# Altium schematic sheet MCU.SchDoc
size A
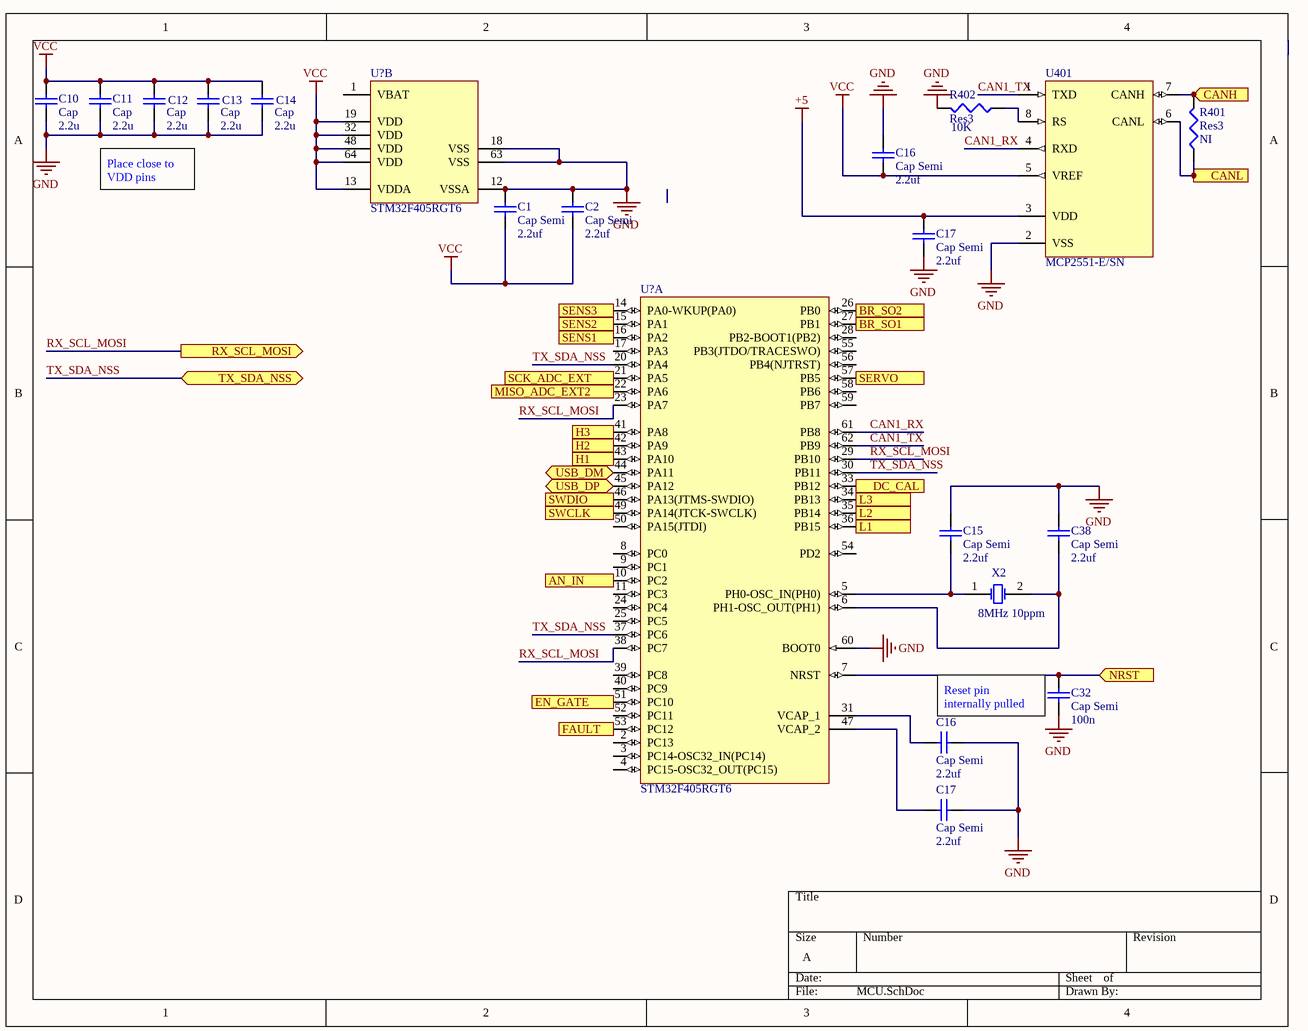
[diagram p0: MCU.SchDoc]

## Parts
(Parts that share a designator on the sheet are numbered #1, #2 ... from top to bottom, then left to right.)
C1  Cap Semi  value 2.2uf  [1608[0603]]
C2  Cap Semi  value 2.2uf  [1608[0603]]
C10  Cap  value 2.2u  [RAD-0.3]
C11  Cap  value 2.2u  [RAD-0.3]
C12  Cap  value 2.2u  [RAD-0.3]
C13  Cap  value 2.2u  [RAD-0.3]
C14  Cap  value 2.2u  [RAD-0.3]
C15  Cap Semi  value 2.2uf  [1608[0603]]
C16#1  Cap Semi  value 2.2uf  [1608[0603]]
C16#2  Cap Semi  value 2.2uf  [1608[0603]]
C17#1  Cap Semi  value 2.2uf  [1608[0603]]
C17#2  Cap Semi  value 2.2uf  [1608[0603]]
C32  Cap Semi  value 100n  [1608[0603]]
C38  Cap Semi  value 2.2uf  [1608[0603]]
R401  Res3  value NI  [J1-0603]
R402  Res3  value 10K  [J1-0603]
U401  MCP2551-E/SN  [SOIC-SN8_N]
U?#1  STM32F405RGT6  [STM-LQFP64_N]  (part B of 2)
U?#2  STM32F405RGT6  [STM-LQFP64_N]  (part A of 2)
X2  8MHz 10ppm  [R38]

## Ports
AN_IN (in), BR_SO1 (in), BR_SO2 (in), CANH (in), CANL (in), DC_CAL (out), EN_GATE (out), FAULT (in), H1 (out), H2 (out), H3 (out), L1 (out), L2 (out), L3 (out), MISO_ADC_EXT2 (in), NRST (in), RX_SCL_MOSI (out), SCK_ADC_EXT (in), SENS1 (in), SENS2 (in), SENS3 (in), SERVO (out), SWCLK (in), SWDIO (in), TX_SDA_NSS (bidir), USB_DM (bidir), USB_DP (bidir)

## Nets
+5: C17#1.2 U401.3(VDD)
GND: C1.2 C2.2 C10.1 C11.1 C12.1 C13.1 C14.1 C15.2 C16#1.2 C16#2.1 C17#1.1 C17#2.1 C32.1 C38.2 R402.2 U401.2(VSS) U?#1.12(VSSA) U?#1.18(VSS) U?#1.63(VSS) U?#2.60(BOOT0)
VCC: C1.1 C2.1 C10.2 C11.2 C12.2 C13.2 C14.2 C16#1.1 U401.5(VREF) U?#1.13(VDDA) U?#1.19(VDD) U?#1.32(VDD) U?#1.48(VDD) U?#1.64(VDD)
AN_IN: U?#2.10(PC2) ; port AN_IN
BR_SO1: U?#2.27(PB1) ; port BR_SO1
BR_SO2: U?#2.26(PB0) ; port BR_SO2
CAN1_RX: U401.4(RXD) U?#2.61(PB8)
CAN1_TX: U401.1(TXD) U?#2.62(PB9)
CANH: R401.2 U401.7(CANH) ; port CANH
CANL: R401.1 U401.6(CANL) ; port CANL
DC_CAL: U?#2.33(PB12) ; port DC_CAL
EN_GATE: U?#2.51(PC10) ; port EN_GATE
FAULT: U?#2.53(PC12) ; port FAULT
H1: U?#2.43(PA10) ; port H1
H2: U?#2.42(PA9) ; port H2
H3: U?#2.41(PA8) ; port H3
L1: U?#2.36(PB15) ; port L1
L2: U?#2.35(PB14) ; port L2
L3: U?#2.34(PB13) ; port L3
MISO_ADC_EXT2: U?#2.22(PA6) ; port MISO_ADC_EXT2
NRST: C32.2 U?#2.7(NRST) ; port NRST
RX_SCL_MOSI: U?#2.23(PA7) U?#2.29(PB10) U?#2.38(PC7) ; port RX_SCL_MOSI
SCK_ADC_EXT: U?#2.21(PA5) ; port SCK_ADC_EXT
SENS1: U?#2.16(PA2) ; port SENS1
SENS2: U?#2.15(PA1) ; port SENS2
SENS3: U?#2.14(PA0-WKUP(PA0)) ; port SENS3
SERVO: U?#2.57(PB5) ; port SERVO
SWCLK: U?#2.49(PA14(JTCK-SWCLK)) ; port SWCLK
SWDIO: U?#2.46(PA13(JTMS-SWDIO)) ; port SWDIO
TX_SDA_NSS: U?#2.20(PA4) U?#2.30(PB11) U?#2.37(PC6) ; port TX_SDA_NSS
USB_DM: U?#2.44(PA11) ; port USB_DM
USB_DP: U?#2.45(PA12) ; port USB_DP
NetC15_1: C15.1 U?#2.5(PH0-OSC_IN(PH0)) X2.1(OSC1)
NetC16#2_2: C16#2.2 U?#2.31(VCAP_1)
NetC17#2_2: C17#2.2 U?#2.47(VCAP_2)
NetC38_1: C38.1 U?#2.6(PH1-OSC_OUT(PH1)) X2.2(OSC2)
NetR402_1: R402.1 U401.8(RS)

Not connected (* = marked no-connect by the designer): U?#1 1(VBAT); U?#2 2(PC13) 3(PC14-OSC32_IN(PC14)) 4(PC15-OSC32_OUT(PC15)) 8(PC0) 9(PC1) 11(PC3) 17(PA3) 24(PC4) 25(PC5) 28(PB2-BOOT1(PB2)) 39(PC8) 40(PC9) 50(PA15(JTDI)) 52(PC11) 54(PD2) 55(PB3(JTDO/TRACESWO)) 56(PB4(NJTRST)) 58(PB6) 59(PB7)

## Notes on the sheet
- Place close to VDD pins
- (near C32) Reset pin internally pulled up

## Library data of the parts
C1 C2 C15 C16#1 C16#2 C17#1 C17#2 C32 C38 = Cap Semi: Capacitor (Semiconductor SIM Model); Published: 8-Jun-2000; LatestRevisionDate: 29-May-2009; LatestRevisionNote: IPC-7351 Footprint Added.; PackageReference: C1206; Publisher: Altium Limited; PackageDescription: Chip Capacitor
C10-C14 = Cap: Capacitor; Published: 8-Jun-2000; LatestRevisionDate: 17-Jul-2002; LatestRevisionNote: Re-released for DXP Platform.; PackageReference: RAD-0.3; Publisher: Altium Limited; PackageDescription: Radial Cap, Thru-Hole; 2 Leads; 0.3 in Pin Spacing
R401 R402 = Res3: Resistor; Published: 8-Jun-2000; LatestRevisionDate: 29-May-2009; LatestRevisionNote: IPC-7351 Footprint Added.; PackageReference: J1-0603; Publisher: Altium Limited; PackageDescription: Chip Resistor
U401 = MCP2551-E/SN: High-Speed CAN Transceiver, 8-Pin SOIC, Extended Temperature; Manufacturer: Microchip; DatasheetVersion: revF, Jul-2010; PackageVersion: revBB, Aug-2009; PackageReference: SOIC-SN8; PackageDescription: 8-Lead Plastic Small Outline (SN) - Narrow, 3.90mm Body [SOIC]; Supplier 1: Digi-Key; Supplier Part Number 1: MCP2551-E/SN-ND; Supplier 2: Farnell; Supplier Part Number 2: 1467746; Supplier 3: Newark; Supplier Part Number 3: 92C4186; Supplier 4: Mouser; Supplier Part Number 4: 579-MCP2551-E/SN; Mounting Technology: Surface Mount; Code_JEDEC: MS-012; Code_IPC: SOIC127P600-8; PartNumber: MCP2551-E/SN; ComponentLink1Description: Manufacturer URL; ComponentLink1URL: http://www.microchip.com/; ComponentLink2Description: Datasheet; ComponentLink2URL: http://ww1.microchip.com/downloads/en/DeviceDoc/21667F.pdf; ComponentLink3Description: Package Specification; ComponentLink3URL: http://www.microchip.com/stellent/groups/techpub_sg/documents/packagingspec/en012702.pdf
U?#1 U?#2 = STM32F405RGT6: ARM Cortex-M4 32-bit MCU+FPU, 210 DMIPS, 1024 kB Flash, 192 kB Internal RAM, 51 I/Os, 64-pin LQFP, -40 to 85 degC, Tray; Manufacturer: STMicroelectronics; D/A Converter: 2x12-bit; FLASH Size (Prog) (kB): 1024; I/Os (High Current): 51; Internal RAM Size (kB): 192; Operating Frequency(F) (Processor speed) (MHz): 168; Supply Voltage(Vcc) max (V): 3.6; Supply Voltage(Vcc) min (V): 1.8; DatasheetVersion: Rev. 4; PackageVersion: Rev. 4, 06/2013; PackageReference: LQFP64; PackageDescription: 64-Pin Low Profile Quad Flat Package, 10 x 10 mm Body, 0.5 mm Pitch; Supplier 1: Digi-Key; Supplier Part Number 1: 497-11767-ND; Supplier 2: Farnell; Supplier Part Number 2: 2064363; Supplier 3: Newark; Supplier Part Number 3: 73T2329; Supplier 4: Mouser; Supplier Part Number 4: 511-STM32F405RGT6; Core: ARM Cortex-M4; Packing: Tray; Mounting Technology: Surface Mount; PartNumber: STM32F405RGT6; ComponentLink1Description: Manufacturer URL; ComponentLink1URL: http://www.st.com/web/en/home.html; ComponentLink2Description: Datasheet; ComponentLink2URL: http://www.st.com/st-web-ui/static/active/en/resource/technical/document/datasheet/DM00037051.pdf; ComponentLink3Description: Package Specification; ComponentLink3URL: http://www.st.com/st-web-ui/static/active/en/resource/technical/document/datasheet/DM00037051.pdf
X2 = XTAL: Crystal Oscillator; Published: 8-Jun-2000; LatestRevisionDate: 17-Jul-2002; LatestRevisionNote: Re-released for DXP Platform.; PackageReference: R38; Publisher: Altium Limited; PackageDescription: Crystal, Thru-Hole; 2 Leads; Body 3.1 x 8.2 mm (Dia.xH)